# EAGLE schematic AVATAR (EAGLE 7.3.0)
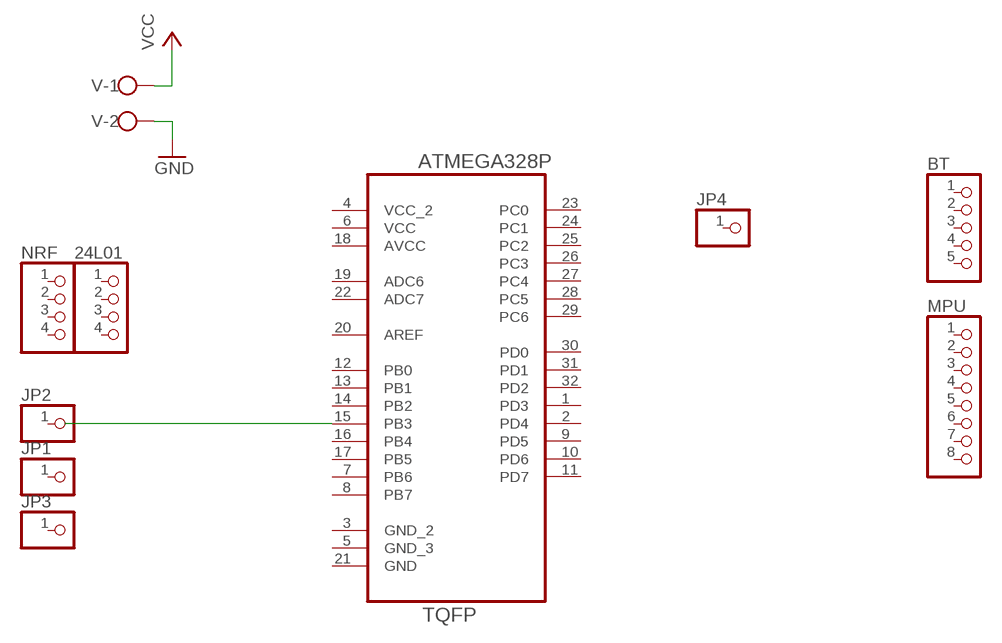
[diagram p0: schematic, sheet 1]

## Parts
24L01  PINHD-1X4  [1X04]
BT  PINHD-1X5  [1X05]
JP1  PINHD-1X1  [1X01]
JP2  PINHD-1X1  [1X01]
JP3  PINHD-1X1  [1X01]
JP4  PINHD-1X1  [1X01]
MPU  PINHD-1X8  [1X08]
NRF  PINHD-1X4  [1X04]
U2  ATMEGA328P-AU  [QFP80P900X900X120-32N]
V  W237-102  [W237-102]

## Nets
GND: V.2
N$1: U2.15(PB3)
VCC: V.1
Unconnected: 24L01.1 24L01.2 24L01.3 24L01.4 BT.1 BT.2 BT.3 BT.4 BT.5 JP1.1 JP2.1 JP3.1 JP4.1 MPU.1 MPU.2 MPU.3 MPU.4 MPU.5 MPU.6 MPU.7 MPU.8 NRF.1 NRF.2 NRF.3 NRF.4 U2.1(PD3) U2.2(PD4) U2.3(GND_2) U2.5(GND_3) U2.7(PB6) U2.8(PB7) U2.9(PD5) U2.10(PD6) U2.11(PD7) U2.12(PB0) U2.13(PB1) U2.14(PB2) U2.16(PB4) U2.17(PB5) U2.19(ADC6) U2.20(AREF) U2.21(GND) U2.22(ADC7) U2.23(PC0) U2.24(PC1) U2.25(PC2) U2.26(PC3) U2.27(PC4) U2.28(PC5) U2.29(PC6) U2.30(PD0) U2.31(PD1) U2.32(PD2)

## Power pins joined to a net without a drawn wire
AVCC: U2.18(AVCC)
VCC: U2.6(VCC)
VCC_2: U2.4(VCC_2)

## Library data of the parts
24L01 NRF = pinhead:PINHD-1X4: PIN HEADER
BT = pinhead:PINHD-1X5: PIN HEADER
JP1-JP4 = pinhead:PINHD-1X1: PIN HEADER
MPU = pinhead:PINHD-1X8: PIN HEADER
U2 = Ava:ATMEGA328P-AU; DESCRIPTION: 8-bit Microcontroller with In-System Programmable Flash; MPN: ATMEGA328P-AU; OC_FARNELL: 1715486; OC_NEWARK: 14R4631; PACKAGE: TQFP-32; SUPPLIER: Atmel
V = con-wago-500:W237-102: WAGO SCREW CLAMP; MPN: 237-102; OC_FARNELL: unknown; OC_NEWARK: 70K9898